# Altium project Gas_Sampler.PrjPcb (part 2 of 3)

## Sheet Gas_Sampler-Vin.SchDoc: Vin
size Tabloid; Organization: Sensible Robotics LLC; Address1: 120 E Church Ave Suite B; Address2: Ridgecrest CA, 93555; Revision: 0; SheetNumber: 3; SheetTotal: 12; ApprovedBy: Approved Name; Engineer: Mike Licitra; PageSetup: Record=PageOptions|CenterHorizontal=True|CenterVertical=True|PrintScale=0.98|XCorrection=1.00|YCorrection=1.00|PrintKind=0|BorderSize=5000000|LeftOffset=0|BottomOffset=0|Orientation=2|PaperLength=1000|PaperWidth=1000|Scale=100|PaperSource=15|PrintQuality=600|MediaType=1|DitherType=10|PaperKind=Tabloid|PrintScaleMode=1
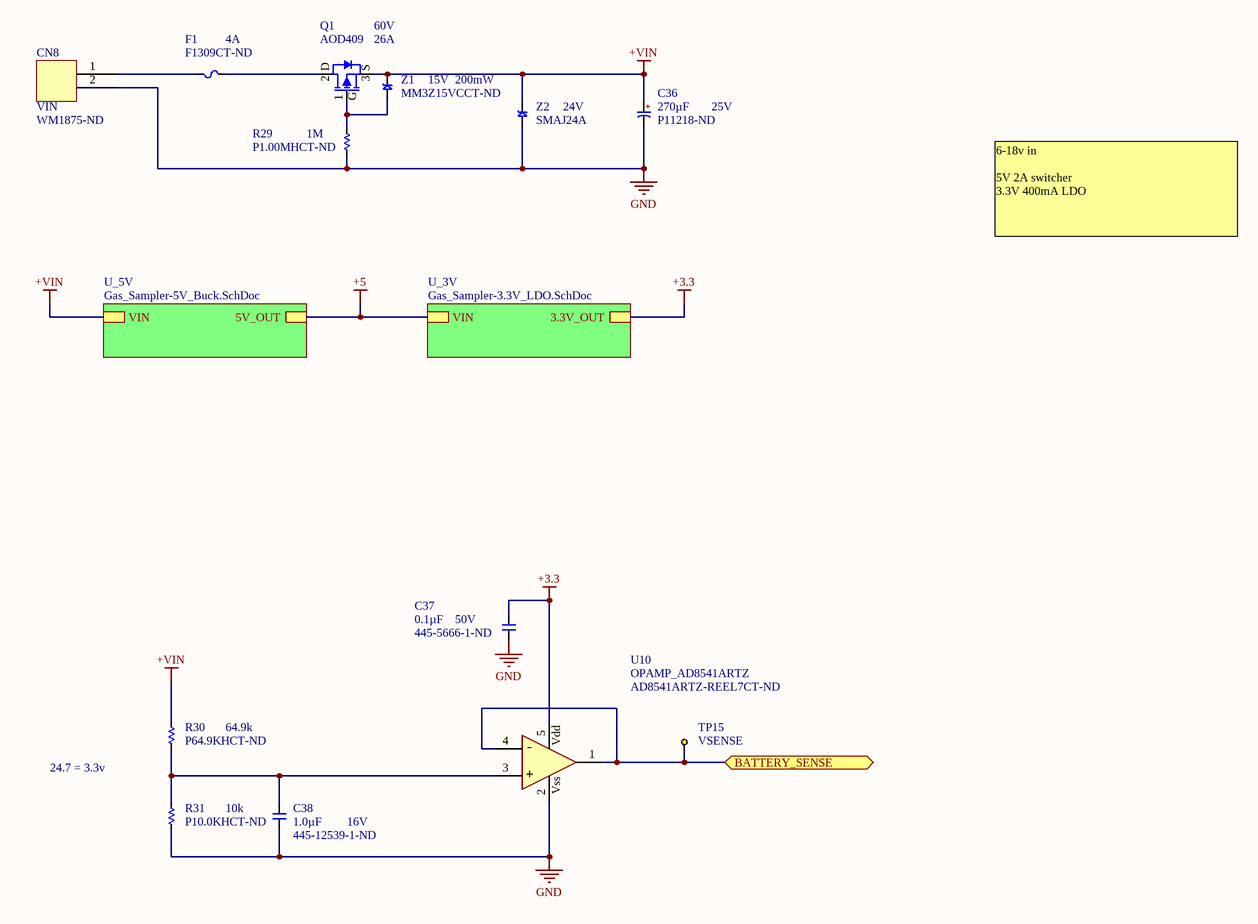
[diagram p7: Gas_Sampler-Vin.SchDoc]

### Parts
C36  value 270µF  Voltage - Rated: 25V  Supplier Part Number 1: P11218-ND  [CAP_RADIAL_10MM_DIA_12.5MM_LEN_5MM_LEADSPACE]  (hidden comment: CAP_ALUM_270UF_25V_20%_RADIAL_10X12.5MM)
C37  value 0.1µF  Voltage - Rated: 50V  Supplier Part Number 1: 445-5666-1-ND  [C0603]  (hidden comment: CAP_CER_0603_0.1UF_50V_10%_X7R)
C38  value 1.0µF  Supplier Part Number 1: 445-12539-1-ND  Voltage - Rated: 16V  [C0603]  (hidden comment: CAP_CER_0603_1UF_16V_10%_X7R)
CN8  VIN  Supplier Part Number 1: WM1875-ND  [MICROFIT_3_SINGLE_ROW_RA_TH_CLIP_2POS]
F1  Supplier Part Number 1: F1309CT-ND  Current Rating: 4A  [FUSEHOLDER_LITTLEFUSE_0154005.DR]  (hidden comment: FUSE_4A_OMNIBLOK_0154004)
Q1  Manufacturer Part Number: AOD409  Drain to Source Voltage (Vdss): 60V  Current - Continuous Drain (Id) @ 25° C: 26A  [DPAK]  (hidden comment: PFET_AOD409)
R29  value 1M  Supplier Part Number 1: P1.00MHCT-ND  [R0603]  (hidden comment: RES_0603_1M_OHM_1/10W_1%)
R30  Supplier Part Number 1: P64.9KHCT-ND  Resistance (Ohms): 64.9k  [R0603]  (hidden comment: RES_0603_64.9K_OHM_1/10W_1%)
R31  value 10k  Supplier Part Number 1: P10.0KHCT-ND  [R0603]  (hidden comment: RES_0603_10K_OHM_1/10W_1%)
TP15  VSENSE  [TP_KEYSTONE_5001]
U10  OPAMP_AD8541ARTZ  Supplier Part Number 1: AD8541ARTZ-REEL7CT-ND  [5SOT23]
Z1  Supplier Part Number 1: MM3Z15VCCT-ND  Power - Max: 200mW  Voltage - Zener (Nom) (Vz): 15V  [SOD323]  (hidden comment: ZENER_MM3Z15VC)
Z2  Voltage - Reverse Standoff (Typ): 24V  Manufacturer Part Number: SMAJ24A  [SMA]  (hidden comment: TVS_UNI_SMAJ24A)

### Sub-sheets
U_3V = Gas_Sampler-3.3V_LDO.SchDoc: VIN, 3.3V_OUT
U_5V = Gas_Sampler-5V_Buck.SchDoc: 5V_OUT, VIN

### Ports
BATTERY_SENSE

### Nets
+3.3: C37.1 U10.5(VDD) ; sheet U_3V/3.3V_OUT
+5: sheet U_5V/5V_OUT, sheet U_3V/VIN
+VIN: C36.1 Q1.3(S) R30.2 Z1.2 Z2.2 ; sheet U_5V/VIN
GND: C36.2 C37.2 C38.2 CN8.2 R29.1 R31.1 U10.2(VSS) Z2.1
BATT_SENSE: TP15.1 U10.1(OUT) U10.4(IN-) ; port BATTERY_SENSE
NetC38_1: C38.1 R30.1 R31.2 U10.3(IN+)
NetCN8_1: CN8.1 F1.1
NetF1_2: F1.2 Q1.2(D)
NetQ1_1: Q1.1(G) R29.2 Z1.1

### Notes on the sheet
- 6-18v in
  5V 2A switcher
  3.3V 400mA LDO
- 24.7 = 3.3v
- CONFIDENTIAL DOCUMENT
- DUPLICATION PROHIBITED
- ENGINEER
- PCB FAB #
- SCH #
- REV
- Sensible
- Robotics
- THIS DOCUMENT CONTAINS INFORMATION AND OR DATA, WHICH IS PROPRIETARY AND CONFIDENTIAL TO SENSIBLE ROBOTICS LLC.  THIS INFORMATION AND OR DATA, IS TO BE USED ONLY FOR THE BENEFIT OF THE SUPPLIER, AND IS NOT TO BE USED FOR THE BENEFIT OF OTHER PARTIES WITHOUT WRITTEN CONSENT.
- DATE
- PCB ASSY #
- SIZE
- Tabloid
- SHEET
- OF
- FILE
- (in symbol CAP_ALUM_270UF_25V_20%_RADIAL_10X12.5MM) +
- (in symbol OPAMP_AD8541ARTZ) Vdd; +; Vss

### Library data of the parts
C36 = CAP_ALUM_270UF_25V_20%_RADIAL_10X12.5MM: CAP ALUM 270UF 20% 25V RADIAL; Manufacturer: Panasonic Electronic Components; Manufacturer Part Number: EEU-FC1E271; Lifetime @ Temp.: 3000 Hrs @ 105°C; Polarization: Polar; Ripple Current - Low Frequency: 490.8mA @ 120Hz; Ripple Current - High Frequency: 755mA @ 100kHz; Supplier 1: Digi-Key; RoHS: RoHS Compliant; Category: Capacitors; Stock 1: 10830; Pricing 1: 1=0.53, 10=0.372, 100=0.2449, 500=0.18144, 1000=0.15422, 2500=0.14515, 5000=0.13608 (USD); Packaging: Bulk; Part Status: Active; Tolerance: ±20%; ESR (Equivalent Series Resistance): -; Operating Temperature: -55°C ~ 105°C; Applications: Automotive; Lead Spacing: 0.197" (5.00mm); Size / Dimension: 0.394" Dia (10.00mm); Height - Seated (Max): 0.492" (12.50mm); Mounting Type: Through Hole; Package / Case: Radial, Can; ComponentLink1URL: http://industrial.panasonic.com/www-cgi/jvcr13pz.cgi?E+PZ+3+ABA0022+EEUFC1E271+7+WW; ComponentLink1Description: http://industrial.panasonic.com/www-cgi/jvcr13pz.cgi?E+PZ+3+ABA0022+EEUFC1E271+7+WW
C37 = CAP_CER_0603_0.1UF_50V_10%_X7R: CAP CER 0.1UF 50V 10% X7R 0603; Manufacturer: TDK Corporation; Manufacturer Part Number: CGA3E2X7R1H104K080AA; Part Number: 150-00077-00; Supplier 1: Digi-Key; RoHS: RoHS Compliant; Category: Capacitors; Stock 1: 320000; Pricing 1: 1=0.1, 10=0.072, 100=0.033, 250=0.027, 500=0.0231, 1000=0.018 (USD); Packaging: Cut Tape (CT); Tolerance: ±10%; Temperature Coefficient: X7R; Mounting Type: Surface Mount, MLCC; Operating Temperature: -55°C ~ 125°C; Applications: Automotive; Ratings: AEC-Q200; Package / Case: 0603 (1608 Metric); Size / Dimension: 0.063" L x 0.031" W (1.60mm x 0.80mm); Height - Seated (Max): -; Thickness (Max): 0.035" (0.90mm); Lead Spacing: -; Features: -; Lead Style: -; ComponentLink1URL: http://product.tdk.com/capacitor/mlcc/en/documents/mlcc_automotive_general_en.pdf; ComponentLink1Description: http://product.tdk.com/capacitor/mlcc/en/documents/mlcc_automotive_general_en.pdf
C38 = CAP_CER_0603_1UF_16V_10%_X7R: CAP CER 1UF 16V 10% X7R 0603; Manufacturer: TDK Corporation; Manufacturer Part Number: CGA3E1X7R1C105K080AC; Supplier 1: Digi-Key; RoHS: RoHS Compliant; Packaging: Cut Tape (CT); Tolerance: ±10%; Temperature Coefficient: X7R; Mounting Type: Surface Mount, MLCC; Operating Temperature: -55°C ~ 125°C; Applications: Automotive; Ratings: AEC-Q200; Package / Case: 0603 (1608 Metric); Size / Dimension: 0.063" L x 0.031" W (1.60mm x 0.80mm); Thickness (Max): 0.035" (0.90mm); ComponentLink1URL: http://product.tdk.com/capacitor/mlcc/en/documents/mlcc_automotive_general_en.pdf; ComponentLink1Description: http://product.tdk.com/capacitor/mlcc/en/documents/mlcc_automotive_general_en.pdf
CN8 = MICROFIT_3_SINGLE_ROW_RA_TH_CLIP_2POS: CONN HEADER 2POS R/A W/CLIP GOLD; Manufacturer: Molex Connector Corporation; Manufacturer Part Number: 43650-0204; Connector Type: Header, Shrouded; Number of Positions: 2; Number of Positions Loaded: All; Pitch: 0.118" (3.00mm); Supplier 1: Digi-Key; RoHS: RoHS Compliant; Packaging: Tray; Contact Type: Male Pin; Number of Rows: 1; Mounting Type: Through Hole, Right Angle; Termination: Solder; Fastening Type: Locking Ramp; Features: Board Lock; Contact Finish: Gold; Contact Finish Thickness: 15µin (0.38µm); Color: Black; ComponentLink1URL: http://www.molex.com/pdm_docs/sd/436500204_sd.pdf; ComponentLink1Description: http://www.molex.com/pdm_docs/sd/436500204_sd.pdf
F1 = FUSE_4A_OMNIBLOK_0154004: FUSE Slow 125VAC, 125VDC 4A SMD; Manufacturer: Littelfuse Inc; Manufacturer Part Number: 0154004.DRT; Part Number: 430-00077-00; Fuse Type: Board Mount (Cartridge Style Excluded); Voltage Rating - AC: 125V; Breaking Capacity @ Rated Voltage: 50A; Melting I²t: 34.4; Approvals: PSE, UL; Color: White; DC Cold Resistance: 0.0186 Ohm; Supplier 1: Digi-Key; RoHS: RoHS Compliant; Category: Circuit Protection; Stock 1: 4331; Pricing 1: 1=3.07, 10=2.781, 25=2.632, 50=2.2414, 100=1.8972, 250=1.85072, 500=1.5624 (USD); Voltage Rating - DC: 125V; Response Time: Slow; Package / Case: 2-SMD, Square End Block with Holder; Mounting Type: Holder/Surface Mount; Operating Temperature: -55°C ~ 125°C; Size / Dimension: 0.383" L x 0.198" W x 0.150" H (9.73mm x 5.03mm x 3.81mm); Packaging: Cut Tape (CT); ComponentLink1URL: http://www.littelfuse.com/products/fuse-blocks-fuseholders-and-fuse-accessories/fuse-blocks/~/media/Files/Littelfuse/Technical%20Resources/Documents/Data%20Sheets/Littelfuse_Fuseblocks_154_155_Datasheet.pdf; ComponentLink1Description: Datasheet
Q1 = PFET_AOD409: MOSFET P-CH -60V -26A TO-252; Manufacturer: Alpha & Omega Semiconductor Inc; FET Type: MOSFET P-Channel, Metal Oxide; FET Feature: Logic Level Gate; Rds On (Max) @ Id, Vgs: 40 mOhm @ 20A, 10V; Vgs(th) (Max) @ Id: 2.4V @ 250µA; Gate Charge (Qg) @ Vgs: 54nC @ 10V; Input Capacitance (Ciss) @ Vds: 3600pF @ 30V; Power - Max: 60W; Supplier 1: Digi-Key; RoHS: RoHS Compliant; Category: Discrete Semiconductor Products; Stock 1: 20027; Pricing 1: 1=0.97, 25=0.7516, 100=0.663, 250=0.5746, 500=0.4862, 1000=0.38675 (USD); Mounting Type: Surface Mount; Package / Case: TO-252-3, DPak (2 Leads + Tab), SC-63; Supplier Device Package: TO-252, (D-Pak); Packaging: Cut Tape (CT); ComponentLink1URL: http://www.aosmd.com/res/data_sheets/AOD409.pdf; ComponentLink1Description: Datasheet; Supplier Part Number 1: 785-1103-1-ND
R29 = RES_0603_1M_OHM_1/10W_1%: RES 1M OHM 1/10W 1% 0603 SMD; Manufacturer: Panasonic Electronic Components; Manufacturer Part Number: ERJ-3EKF1004V; Power (Watts): 0.1W, 1/10W; Temperature Coefficient: ±100ppm/°C; Supplier 1: Digi-Key; RoHS: RoHS Compliant; Category: Resistors; Stock 1: 1614014; Pricing 1: 1=0.1, 50=0.0138, 100=0.0105, 250=0.0078, 500=0.00576, 1000=0.00384 (USD); Packaging: Cut Tape (CT); Composition: Thick Film; Features: -; Tolerance: ±1%; Package / Case: 0603 (1608 Metric); Supplier Device Package: 0603; Size / Dimension: 0.063" L x 0.031" W (1.60mm x 0.80mm); Height: 0.022" (0.55mm); Number of Terminations: 2; ComponentLink1URL: http://industrial.panasonic.com/www-cgi/jvcr13pz.cgi?E+PZ+3+AOA0002+ERJ3EKF1004V+7+WW; ComponentLink1Description: http://industrial.panasonic.com/www-cgi/jvcr13pz.cgi?E+PZ+3+AOA0002+ERJ3EKF1004V+7+WW
R30 = RES_0603_64.9K_OHM_1/10W_1%: RES 64.9K OHM 1% 1/10W 0603; Manufacturer: Panasonic Electronic Components; Manufacturer Part Number: ERJ3EKF6492V; Part Number: 470-02041-00; Power (Watts): 0.1W, 1/10W; Temperature Coefficient: ±100ppm/°C; Supplier 1: Digi-Key; RoHS: RoHS Compliant; Category: Resistors; Stock 1: 97260; Pricing 1: 1=0.1, 50=0.0114, 100=0.0084, 250=0.00644, 500=0.00514, 1000=0.00379 (USD); Packaging: Cut Tape (CT); Composition: Thick Film; Features: Automotive AEC-Q200; Operating Temperature: -55°C ~ 155°C; Package / Case: 0603 (1608 Metric); Supplier Device Package: 0603; Size / Dimension: 0.063" L x 0.031" W (1.60mm x 0.80mm); Height: 0.022" (0.55mm); Number of Terminations: 2; ComponentLink1URL: http://industrial.panasonic.com/www-cgi/jvcr13pz.cgi?E+PZ+3+AOA0002+ERJ3EKF6492V+7+WW; ComponentLink1Description: http://industrial.panasonic.com/www-cgi/jvcr13pz.cgi?E+PZ+3+AOA0002+ERJ3EKF6492V+7+WW; Tolerance: ±1%
R31 = RES_0603_10K_OHM_1/10W_1%: RES 10K OHM 1/10W 1% 0603 SMD; Manufacturer: Panasonic Electronic Components; Manufacturer Part Number: ERJ-3EKF1002V; Power (Watts): 0.1W, 1/10W; Temperature Coefficient: ±100ppm/°C; Supplier 1: Digi-Key; RoHS: RoHS Compliant; Packaging: Cut Tape (CT); Composition: Thick Film; Tolerance: ±1%; Package / Case: 0603 (1608 Metric); Supplier Device Package: 0603; Size / Dimension: 0.063" L x 0.031" W (1.60mm x 0.80mm); Height: 0.022" (0.55mm); Number of Terminations: 2; ComponentLink1URL: http://industrial.panasonic.com/www-cgi/jvcr13pz.cgi?E+PZ+3+AOA0002+ERJ3EKF1002V+7+WW; ComponentLink1Description: http://industrial.panasonic.com/www-cgi/jvcr13pz.cgi?E+PZ+3+AOA0002+ERJ3EKF1002V+7+WW
TP15 = TEST_KEYSTONE5001: PC TEST POINT TH RING; Manufacturer: Keystone Electronics; Manufacturer Part Number: 5001; Part Number: 250-00184-00; Supplier 1: Digi-Key; Supplier Part Number 1: 5001K-ND; RoHS: RoHS Compliant; Category: Test and Measurement; Stock 1: 341830; Pricing 1: 1=0.33, 10=0.309, 50=0.2252, 100=0.2164, 250=0.19432, 500=0.18548, 1000=0.15456, 2500=0.14131, 5000=0.13248 (USD); Packaging: Bulk; Type: PC Test Point, Miniature; Terminal: 0.010" x 0.020" (0.25mm x 0.51mm) Phosphor Bronze Wire, Silver Plate; Mounting Type: 0.040" (1.02mm) Hole Diameter; Material: Base, Nylon 46, UL 94V-0; Color: Black; ComponentLink1URL: http://www.keyelco.com/product-pdf.cfm?p=1310; ComponentLink1Description: http://www.keyelco.com/product-pdf.cfm?p=1310
U10 = OPAMP_AD8541ARTZ: IC OPAMP GP R-R CMOS SOT23-5; Manufacturer: Analog Devices Inc; Manufacturer Part Number: AD8541ARTZ-REEL7; Part Number: 480-00120-00; Amplifier Type: General Purpose; Number of Circuits: 1; Output Type: Rail-to-Rail; Slew Rate: 0.92 V/µs; Gain Bandwidth Product: 1MHz; Current - Input Bias: 4pA; Voltage - Input Offset: 1mV; Current - Supply: 45µA; Current - Output / Channel: 30mA; Voltage - Supply, Single/Dual (±): 2.7 V ~ 5.5 V; Supplier 1: Digi-Key; RoHS: RoHS Compliant; Category: Integrated Circuits (ICs); Stock 1: 26612; Pricing 1: 1=0.85, 10=0.747, 25=0.6604, 100=0.5755, 250=0.50096, 500=0.42642, 1000=0.34155 (USD); Packaging: Cut Tape (CT); -3db Bandwidth: -; Operating Temperature: -40°C ~ 125°C; Mounting Type: Surface Mount; Package / Case: SC-74A, SOT-753; Supplier Device Package: SOT-23-5; ComponentLink1URL: http://www.analog.com/static/imported-files/data_sheets/AD8541_8542_8544.pdf; ComponentLink1Description: http://www.analog.com/static/imported-files/data_sheets/AD8541_8542_8544.pdf
Z1 = ZENER_MM3Z15VC: DIODE ZENER 15V 200MW SOD; Manufacturer: Fairchild Semiconductor; Part Number: 480-00176-00; Voltage - Forward (Vf) (Max) @ If: 1V @ 10mA; Current - Reverse Leakage @ Vr: 45nA @ 10.5V; Impedance (Max) (Zzt): 28 Ohm; Tolerance: ±5%; Supplier 1: Digi-Key; Manufacturer Part Number: MM3Z15VC; RoHS: RoHS Compliant; Category: Discrete Semiconductor Products; Stock 1: 30597; Pricing 1: 1=0.44, 10=0.29, 100=0.126, 250=0.08192, 500=0.05796, 750=0.04788, 1000=0.04095 (USD); Mounting Type: Surface Mount; Package / Case: SC-90, SOD-323F; Supplier Device Package: SOD-323F; Packaging: Cut Tape (CT); Operating Temperature: -65°C ~ 150°C; ComponentLink1URL: http://www.fairchildsemi.com/ds/MM/MM3Z10VC.pdf; ComponentLink1Description: Datasheet
Z2 = TVS_UNI_SMAJ24A: TVS DIODE 24VWM SMD; Manufacturer: Bourns Inc.; Part Number: 430-00161-00; Unidirectional Channels: 1; Voltage - Breakdown (Min): 26.7V; Power - Peak Pulse: 400W; Power Line Protection: No; Supplier 1: Digi-Key; Supplier Part Number 1: SMAJ24ABCT-ND; RoHS: RoHS Compliant; Category: Circuit Protection; Stock 1: 27086; Pricing 1: 1=0.53, 10=0.377, 25=0.3096, 100=0.2473, 250=0.1802, 500=0.14632, 1000=0.11248, 2500=0.10101 (USD); Packaging: Cut Tape (CT); Type: Zener; Bidirectional Channels: -; Voltage - Clamping (Max) @ Ipp: -; Current - Peak Pulse (10/1000µs): -; Applications: General Purpose; Capacitance @ Frequency: -; Operating Temperature: -55°C ~ 150°C (TJ); Mounting Type: Surface Mount; Package / Case: DO-214AC, SMA; Supplier Device Package: SMA (DO-214AC); ComponentLink1URL: http://www.bourns.com/data/global/pdfs/SMAJ.pdf; ComponentLink1Description: http://www.bourns.com/data/global/pdfs/SMAJ.pdf

## Sheet Gas_Sampler-5V_Buck.SchDoc: 5V Buck
size Tabloid; Organization: Sensible Robotics LLC; Address1: 120 E Church Ave Suite B; Address2: Ridgecrest CA, 93555; Revision: 0; SheetNumber: 4; SheetTotal: 12; ApprovedBy: Approved Name; Engineer: Mike Licitra; PageSetup: Record=PageOptions|CenterHorizontal=True|CenterVertical=True|PrintScale=0.98|XCorrection=1.00|YCorrection=1.00|PrintKind=0|BorderSize=5000000|LeftOffset=0|BottomOffset=0|Orientation=2|PaperLength=1000|PaperWidth=1000|Scale=100|PaperSource=15|PrintQuality=600|MediaType=1|DitherType=10|PaperKind=Tabloid|PrintScaleMode=1
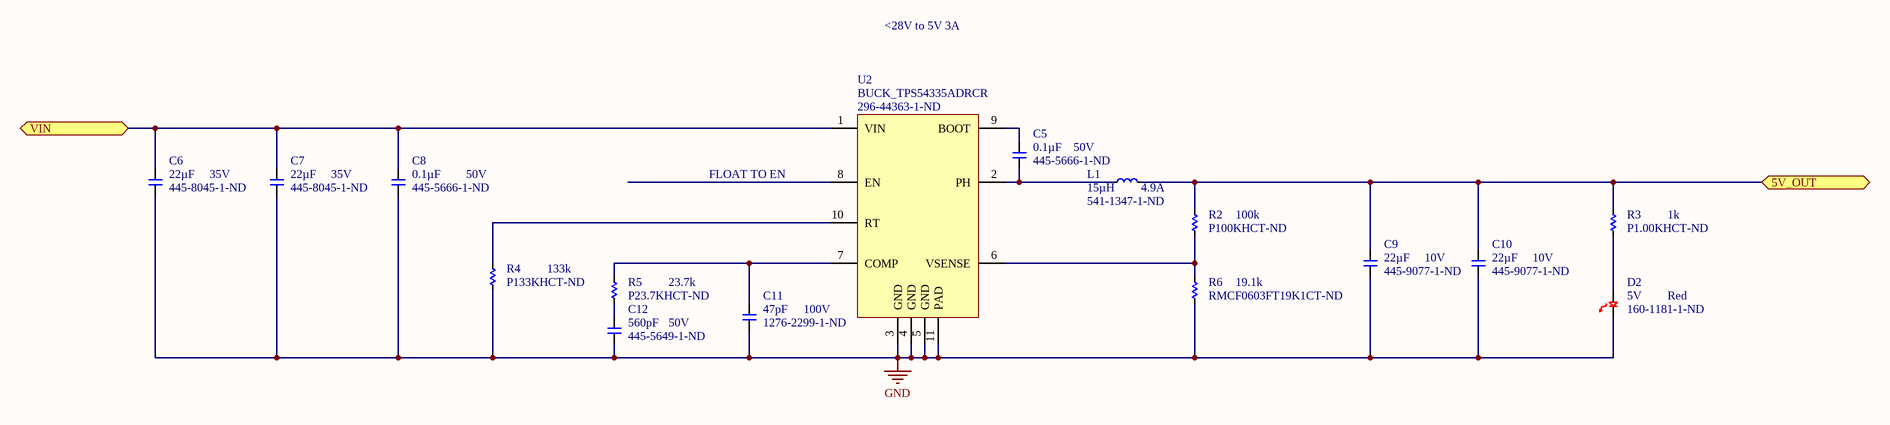
[diagram p8: Gas_Sampler-5V_Buck.SchDoc]

### Parts
C5  value 0.1µF  Voltage - Rated: 50V  Supplier Part Number 1: 445-5666-1-ND  [C0603]  (hidden comment: CAP_CER_0603_0.1UF_50V_10%_X7R)
C6  value 22µF  Voltage - Rated: 35V  Supplier Part Number 1: 445-8045-1-ND  [C1206]  (hidden comment: CAP_CER_1206_22UF_35V_20%_X5R)
C7  value 22µF  Voltage - Rated: 35V  Supplier Part Number 1: 445-8045-1-ND  [C1206]  (hidden comment: CAP_CER_1206_22UF_35V_20%_X5R)
C8  value 0.1µF  Voltage - Rated: 50V  Supplier Part Number 1: 445-5666-1-ND  [C0603]  (hidden comment: CAP_CER_0603_0.1UF_50V_10%_X7R)
C9  value 22µF  Supplier Part Number 1: 445-9077-1-ND  Voltage - Rated: 10V  [C0603]  (hidden comment: CAP_CER_0603_22UF_10V_20%_X5R)
C10  value 22µF  Supplier Part Number 1: 445-9077-1-ND  Voltage - Rated: 10V  [C0603]  (hidden comment: CAP_CER_0603_22UF_10V_20%_X5R)
C11  value 47pF  Voltage - Rated: 100V  Supplier Part Number 1: 1276-2299-1-ND  [C0603]  (hidden comment: CAP_CER_0603_47PF_100V_5%_NP0)
C12  value 560pF  Supplier Part Number 1: 445-5649-1-ND  Voltage - Rated: 50V  [C0603]  (hidden comment: CAP_CER_0603_560PF_50V_5%_NP0)
D2  5V  Supplier Part Number 1: 160-1181-1-ND  Color: Red  [LED_0603_RED]
L1  value 15µH  Current Rating: 4.9A  Supplier Part Number 1: 541-1347-1-ND  [INDUCTOR_IHLP3232_4MM_HEIGHT]  (hidden comment: IND_15UH_4.9A_IHLP3232DZER150M11)
R2  value 100k  Supplier Part Number 1: P100KHCT-ND  [R0603]  (hidden comment: RES_0603_100K_OHM_1/10W_1%)
R3  value 1k  Supplier Part Number 1: P1.00KHCT-ND  [R0603]  (hidden comment: RES_0603_1K_OHM_1/10W_1%)
R4  value 133k  Supplier Part Number 1: P133KHCT-ND  [R0603]  (hidden comment: RES_0603_133K_OHM_1/10W_1%)
R5  value 23.7k  Supplier Part Number 1: P23.7KHCT-ND  [R0603]  (hidden comment: RES_0603_23.7K_OHMS_1/10W_1%)
R6  value 19.1k  Supplier Part Number 1: RMCF0603FT19K1CT-ND  [R0603]  (hidden comment: RES_0603_19.1K_OHM_1/10W_1%)
U2  BUCK_TPS54335ADRCR  Supplier Part Number 1: 296-44363-1-ND  [PVSON50P300X300X70-10N]

### Ports
5V_OUT, VIN

### Nets
+5: C9.1 C10.1 L1.2 R2.2 R3.2 ; port 5V_OUT
+VIN: C6.1 C7.1 C8.1 U2.1(VIN) ; port VIN
GND: C6.2 C7.2 C8.2 C9.2 C10.2 C11.2 C12.2 D2.2(CATHODE) R4.1 R6.1 U2.3(GND) U2.4(GND) U2.5(GND) U2.11(PAD)
NetC5_1: C5.1 U2.9(BOOT)
NetC5_2: C5.2 L1.1 U2.2(PH)
NetC11_1: C11.1 R5.2 U2.7(COMP)
NetC12_1: C12.1 R5.1
NetD2_1: D2.1(ANODE) R3.1
NetR2_1: R2.1 R6.2 U2.6(VSENSE)
NetR4_2: R4.2 U2.10(RT)

Not connected (* = marked no-connect by the designer): U2 8(EN)

### Notes on the sheet
- <28V to 5V 3A
- FLOAT TO EN
- CONFIDENTIAL DOCUMENT
- DUPLICATION PROHIBITED
- ENGINEER
- PCB FAB #
- SCH #
- REV
- Sensible
- Robotics
- THIS DOCUMENT CONTAINS INFORMATION AND OR DATA, WHICH IS PROPRIETARY AND CONFIDENTIAL TO SENSIBLE ROBOTICS LLC.  THIS INFORMATION AND OR DATA, IS TO BE USED ONLY FOR THE BENEFIT OF THE SUPPLIER, AND IS NOT TO BE USED FOR THE BENEFIT OF OTHER PARTIES WITHOUT WRITTEN CONSENT.
- DATE
- PCB ASSY #
- SIZE
- Tabloid
- SHEET
- OF
- FILE

### Library data of the parts
C5 C8 = CAP_CER_0603_0.1UF_50V_10%_X7R: as C22 on sheet Gas_Sampler-BME_280; Supplier 1: Digi-Key; RoHS: RoHS Compliant; Packaging: Cut Tape (CT); Tolerance: ±10%; Temperature Coefficient: X7R; Mounting Type: Surface Mount, MLCC; Operating Temperature: -55°C ~ 125°C; Applications: Automotive; Ratings: AEC-Q200; Package / Case: 0603 (1608 Metric); Size / Dimension: 0.063" L x 0.031" W (1.60mm x 0.80mm); Thickness (Max): 0.035" (0.90mm); ComponentLink1URL: http://product.tdk.com/capacitor/mlcc/en/documents/mlcc_automotive_general_en.pdf; ComponentLink1Description: http://product.tdk.com/capacitor/mlcc/en/documents/mlcc_automotive_general_en.pdf
C6 C7 = CAP_CER_1206_22UF_35V_20%_X5R: CAP CER 22UF 35V X5R 1206; Manufacturer: TDK Corporation; Manufacturer Part Number: C3216X5R1V226M160AC; Tolerance: ±20%; Supplier 1: Digi-Key; RoHS: RoHS Compliant; Packaging: Cut Tape (CT); Temperature Coefficient: X5R; Mounting Type: Surface Mount, MLCC; Operating Temperature: -55°C ~ 85°C; Applications: General Purpose; Package / Case: 1206 (3216 Metric); Size / Dimension: 0.126" L x 0.063" W (3.20mm x 1.60mm); Thickness (Max): 0.071" (1.80mm); Features: Low ESL; ComponentLink1URL: https://product.tdk.com/info/en/catalog/datasheets/mlcc_commercial_general_en.pdf; ComponentLink1Description: https://product.tdk.com/info/en/catalog/datasheets/mlcc_commercial_general_en.pdf
C9 C10 = CAP_CER_0603_22UF_10V_20%_X5R: CAP CER 22UF 10V 20% X5R 0603; Manufacturer: TDK Corporation; Manufacturer Part Number: C1608X5R1A226M080AC; Part Number: 150-00202-00; Supplier 1: Digi-Key; Temperature Coefficient: X5R; Tolerance: ±20%
C11 = CAP_CER_0603_47PF_100V_5%_NP0: CAP CER 47PF 100V C0G/NP0 0603; Manufacturer: Samsung Electro-Mechanics; Manufacturer Part Number: CL10C470JC8NNNC; Tolerance: ±5%; Temperature Coefficient: C0G, NP0; Supplier 1: Digi-Key; RoHS: RoHS Compliant; Packaging: Cut Tape (CT); Mounting Type: Surface Mount, MLCC; Operating Temperature: -55°C ~ 125°C; Applications: General Purpose; Package / Case: 0603 (1608 Metric); Size / Dimension: 0.063" L x 0.031" W (1.60mm x 0.80mm); Thickness (Max): 0.035" (0.90mm); ComponentLink1URL: http://www.samsungsem.com/kr/support/product-search/mlcc/CL10C470JC8NNNC.jsp; ComponentLink1Description: Datasheet
C12 = CAP_CER_0603_560PF_50V_5%_NP0: CAP CER 560PF 50V 5% NP0 0603; Manufacturer: TDK Corporation; Manufacturer Part Number: CGA3E2C0G1H561J080AA; Temperature Coefficient: C0G, NP0; Supplier 1: Digi-Key; RoHS: RoHS Compliant; Packaging: Cut Tape (CT); Tolerance: ±5%; Mounting Type: Surface Mount, MLCC; Operating Temperature: -55°C ~ 125°C; Applications: Automotive; Ratings: AEC-Q200; Package / Case: 0603 (1608 Metric); Size / Dimension: 0.063" L x 0.031" W (1.60mm x 0.80mm); Thickness (Max): 0.035" (0.90mm); ComponentLink1URL: http://product.tdk.com/capacitor/mlcc/en/documents/mlcc_automotive_general_en.pdf; ComponentLink1Description: http://product.tdk.com/capacitor/mlcc/en/documents/mlcc_automotive_general_en.pdf
D2 = LED_0603_RED_LR_LTST-C190CKT: LED RED CLEAR 0603 SMD; Manufacturer: Lite-On Inc; Millicandela Rating: 10mcd; Wavelength - Dominant: 638nm; Wavelength - Peak: 660nm; Viewing Angle: 130°; Lens Style/Size: Rectangle with Flat Top, 1.1mm x 0.8mm; Voltage - Forward (Vf) Typ: 1.8V; Current - Test: 10mA; Supplier 1: Digi-Key; Manufacturer Part Number: LTST-C190CKT; Lens Type: Clear; Package / Case: 0603 (1608 Metric); Size / Dimension: 1.60mm L x 0.80mm W; Height: 0.80mm; Mounting Type: Surface Mount; Packaging: Cut Tape (CT); ComponentLink1URL: http://media.digikey.com/pdf/Data%20Sheets/Lite-On%20PDFs/LTST-C190CKT.pdf; ComponentLink1Description: Datasheet
L1 = IND_15UH_4.9A_IHLP3232DZER150M11: INDUCTOR POWER 15UH 4.9A SMD; Manufacturer: Vishay Dale; Tolerance: ±20%; Current - Saturation: 3.7A; Shielding: Shielded; DC Resistance (DCR): 65.3 mOhm Max; Frequency - Test: 100kHz; Supplier 1: Digi-Key; Manufacturer Part Number: IHLP3232DZER150M11; RoHS: RoHS Compliant; Category: Inductors, Coils, Chokes; Packaging: Cut Tape (CT); Operating Temperature: -55°C ~ 125°C; Mounting Type: Surface Mount; Package / Case: Non Standard; Size / Dimension: 0.340" L x 0.322" W (8.64mm x 8.18mm); Height - Seated (Max): 0.158" (4.00mm); ComponentLink1URL: http://media.digikey.com/PDF/Data%20Sheets/Vishay%20Dale%20PDFs/IHLP-3232DZ-11.pdf; ComponentLink1Description: http://media.digikey.com/PDF/Data%20Sheets/Vishay%20Dale%20PDFs/IHLP-3232DZ-11.pdf
R2 = RES_0603_100K_OHM_1/10W_1%: RES 100K OHM 1/10W 1% 0603 SMD; Manufacturer: Panasonic Electronic Components; Manufacturer Part Number: ERJ-3EKF1003V; Part Number: 470-00120-00; Power (Watts): 0.1W, 1/10W; Temperature Coefficient: ±100ppm/°C; Supplier 1: Digi-Key; RoHS: RoHS Compliant; Category: Resistors; Stock 1: 8082554; Pricing 1: 1=0.1, 50=0.0138, 100=0.0105, 250=0.0078, 500=0.00576, 1000=0.00384 (USD); Packaging: Cut Tape (CT); Composition: Thick Film; Features: -; Tolerance: ±1%; Package / Case: 0603 (1608 Metric); Supplier Device Package: 0603; Size / Dimension: 0.063" L x 0.031" W (1.60mm x 0.80mm); Height: 0.022" (0.55mm); Number of Terminations: 2; ComponentLink1URL: http://industrial.panasonic.com/www-cgi/jvcr13pz.cgi?E+PZ+3+AOA0002+ERJ3EKF1003V+7+WW; ComponentLink1Description: http://industrial.panasonic.com/www-cgi/jvcr13pz.cgi?E+PZ+3+AOA0002+ERJ3EKF1003V+7+WW
R3 = RES_0603_1K_OHM_1/10W_1%: RES 1K OHM 1/10W 1% 0603 SMD; Manufacturer: Panasonic Electronic Components; Manufacturer Part Number: ERJ-3EKF1001V; Power (Watts): 0.1W, 1/10W; Temperature Coefficient: ±100ppm/°C; Supplier 1: Digi-Key; RoHS: RoHS Compliant; Packaging: Cut Tape (CT); Composition: Thick Film; Features: -; Tolerance: ±1%; Package / Case: 0603 (1608 Metric); Supplier Device Package: 0603; Size / Dimension: 0.063" L x 0.031" W (1.60mm x 0.80mm); Height: 0.022" (0.55mm); Number of Terminations: 2; ComponentLink1URL: http://industrial.panasonic.com/www-cgi/jvcr13pz.cgi?E+PZ+3+AOA0002+ERJ3EKF1001V+7+WW; ComponentLink1Description: http://industrial.panasonic.com/www-cgi/jvcr13pz.cgi?E+PZ+3+AOA0002+ERJ3EKF1001V+7+WW
R4 = RES_0603_133K_OHM_1/10W_1%: RES 133K OHM 1% 1/10W 0603; Manufacturer: Panasonic Electronic Components; Manufacturer Part Number: ERJ-3EKF1333V; Power (Watts): 0.1W, 1/10W; Temperature Coefficient: ±100ppm/°C; Supplier 1: Digi-Key; Packaging: Cut Tape (CT); Tolerance: ±1%; Composition: Thick Film; Features: Automotive AEC-Q200; Operating Temperature: -55°C ~ 155°C; Package / Case: 0603 (1608 Metric); Supplier Device Package: 0603; Height: 0.022" (0.55mm); Number of Terminations: 2; ComponentLink1URL: http://industrial.panasonic.com/www-cgi/jvcr13pz.cgi?E+PZ+3+AOA0002+ERJ3EKF1183V+7+WW; ComponentLink1Description: http://industrial.panasonic.com/www-cgi/jvcr13pz.cgi?E+PZ+3+AOA0002+ERJ3EKF1183V+7+WW
R5 = RES_0603_23.7K_OHMS_1/10W_1%: RES 23.7K OHM 1% 1/10W 0603; Manufacturer: Panasonic Electronic Components; Manufacturer Part Number: ERJ-3EKF2372V; Power (Watts): 0.1W, 1/10W; Temperature Coefficient: ±100ppm/°C; Supplier 1: Digi-Key; RoHS: RoHS Compliant; Category: Resistors; Stock 1: 58901; Pricing 1: 1=0.1, 10=0.063, 100=0.0257, 1000=0.01153, 2500=0.01001 (USD); Packaging: Cut Tape (CT); Part Status: Active; Tolerance: ±1%; Composition: Thick Film; Features: Automotive AEC-Q200; Operating Temperature: -55°C ~ 155°C; Package / Case: 0603 (1608 Metric); Supplier Device Package: 0603; Size / Dimension: 0.063" L x 0.032" W (1.60mm x 0.80mm); Height - Seated (Max): 0.022" (0.55mm); ComponentLink1URL: https://industrial.panasonic.com/cdbs/www-data/pdf/RDA0000/AOA0000C304.pdf; ComponentLink1Description: https://industrial.panasonic.com/cdbs/www-data/pdf/RDA0000/AOA0000C304.pdf
R6 = RES_0603_19.1K_OHM_1/10W_1%: RES 19.1K OHM 1% 1/10W 0603; Manufacturer: Stackpole Electronics Inc; Manufacturer Part Number: RMCF0603FT19K1; Power (Watts): 0.1W, 1/10W; Temperature Coefficient: ±100ppm/°C; Supplier 1: Digi-Key; Packaging: Cut Tape (CT); Tolerance: ±1%; Composition: Thick Film; Features: Moisture Resistant; Operating Temperature: -55°C ~ 155°C; Package / Case: 0603 (1608 Metric); Supplier Device Package: 0603; Height: 0.022" (0.55mm); Number of Terminations: 2; ComponentLink1URL: https://www.seielect.com/catalog/sei-rmcf_rmcp.pdf; ComponentLink1Description: https://www.seielect.com/catalog/sei-rmcf_rmcp.pdf
U2 = BUCK_TPS54335ADRCR: IC REG BUCK ADJUSTABLE 3A 10VSON; Manufacturer: Texas Instruments; Function: Step-Down; Output Configuration: Positive; Number of Outputs: 1; Voltage - Input (Min): 4.5V; Voltage - Input (Max): 28V; Voltage - Output (Min/Fixed): 0.8V; Voltage - Output (Max): 24V; Frequency - Switching: 50kHz ~ 1.5MHz; Synchronous Rectifier: Yes; Supplier 1: Digi-Key; Manufacturer Part Number: TPS54335ADRCR; Packaging: Cut Tape (CT); Topology: Buck; Output Type: Adjustable; Current - Output: 3A; Operating Temperature: -40°C ~ 85°C (TA); Mounting Type: Surface Mount; Package / Case: 10-VFDFN Exposed Pad; Supplier Device Package: 10-VSON (3x3); ComponentLink1URL: http://www.ti.com/general/docs/suppproductinfo.tsp?distId=10&gotoUrl=http%3A%2F%2Fwww.ti.com%2Flit%2Fgpn%2Ftps54335a; ComponentLink1Description: http://www.ti.com/general/docs/suppproductinfo.tsp?distId=10&gotoUrl=http%3A%2F%2Fwww.ti.com%2Flit%2Fgpn%2Ftps54335a

## Sheet Gas_Sampler-3.3V_LDO.SchDoc: 3.3V LDO
size Tabloid; Organization: Sensible Robotics LLC; Address1: 120 E Church Ave Suite B; Address2: Ridgecrest CA, 93555; Revision: 0; SheetNumber: 5; SheetTotal: 12; ApprovedBy: Approved Name; Engineer: Mike Licitra; PageSetup: Record=PageOptions|CenterHorizontal=True|CenterVertical=True|PrintScale=0.98|XCorrection=1.00|YCorrection=1.00|PrintKind=0|BorderSize=5000000|LeftOffset=0|BottomOffset=0|Orientation=2|PaperLength=1000|PaperWidth=1000|Scale=100|PaperSource=15|PrintQuality=600|MediaType=1|DitherType=10|PaperKind=Tabloid|PrintScaleMode=1
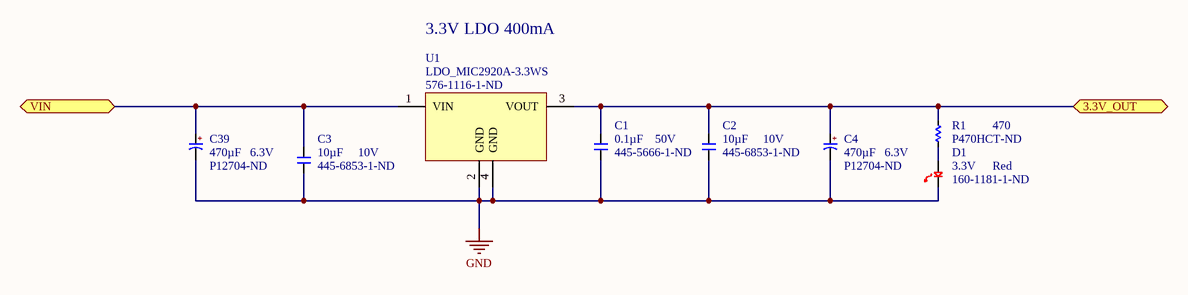
[diagram p9: Gas_Sampler-3.3V_LDO.SchDoc]

### Parts
C1  value 0.1µF  Voltage - Rated: 50V  Supplier Part Number 1: 445-5666-1-ND  [C0603]  (hidden comment: CAP_CER_0603_0.1UF_50V_10%_X7R)
C2  value 10µF  Voltage - Rated: 10V  Supplier Part Number 1: 445-6853-1-ND  [C0603]  (hidden comment: CAP_CER_0603_10UF_10V_20%_X5R)
C3  value 10µF  Voltage - Rated: 10V  Supplier Part Number 1: 445-6853-1-ND  [C0603]  (hidden comment: CAP_CER_0603_10UF_10V_20%_X5R)
C4  value 470µF  Voltage - Rated: 6.3V  Supplier Part Number 1: P12704-ND  [CAP_RADIAL_8MM_DIA_11.5MM_LEN_3.5MM_LEADSPACE]  (hidden comment: CAP_ALUM_470UF_6.3V_20%_RADIAL_8X11.5MM)
C39  value 470µF  Voltage - Rated: 6.3V  Supplier Part Number 1: P12704-ND  [CAP_RADIAL_8MM_DIA_11.5MM_LEN_3.5MM_LEADSPACE]  (hidden comment: CAP_ALUM_470UF_6.3V_20%_RADIAL_8X11.5MM)
D1  3.3V  Supplier Part Number 1: 160-1181-1-ND  Color: Red  [LED_0603_RED]
R1  value 470  Supplier Part Number 1: P470HCT-ND  [R0603]  (hidden comment: RES_0603_470_OHM_1/10W_1%)
U1  LDO_MIC2920A-3.3WS  Supplier Part Number 1: 576-1116-1-ND  [4SOT223]

### Ports
3.3V_OUT, VIN

### Nets
+3.3: C1.1 C2.1 C4.1 R1.2 U1.3(VOUT) ; port 3.3V_OUT
+5: C3.1 C39.1 U1.1(VIN) ; port VIN
GND: C1.2 C2.2 C3.2 C4.2 C39.2 D1.2(CATHODE) U1.2(GND) U1.4(GND)
NetD1_1: D1.1(ANODE) R1.1

### Notes on the sheet
- 3.3V LDO 400mA
- CONFIDENTIAL DOCUMENT
- DUPLICATION PROHIBITED
- ENGINEER
- PCB FAB #
- SCH #
- REV
- Sensible
- Robotics
- THIS DOCUMENT CONTAINS INFORMATION AND OR DATA, WHICH IS PROPRIETARY AND CONFIDENTIAL TO SENSIBLE ROBOTICS LLC.  THIS INFORMATION AND OR DATA, IS TO BE USED ONLY FOR THE BENEFIT OF THE SUPPLIER, AND IS NOT TO BE USED FOR THE BENEFIT OF OTHER PARTIES WITHOUT WRITTEN CONSENT.
- DATE
- PCB ASSY #
- SIZE
- Tabloid
- SHEET
- OF
- FILE
- (in symbol CAP_ALUM_470UF_6.3V_20%_RADIAL_8X11.5MM) +

### Library data of the parts
C1 = CAP_CER_0603_0.1UF_50V_10%_X7R: as C37 on sheet Gas_Sampler-Vin; Supplier 1: Digi-Key; RoHS: RoHS Compliant; Category: Capacitors; Stock 1: 320000; Pricing 1: 1=0.1, 10=0.072, 100=0.033, 250=0.027, 500=0.0231, 1000=0.018 (USD); Packaging: Cut Tape (CT); Tolerance: ±10%; Temperature Coefficient: X7R; Mounting Type: Surface Mount, MLCC; Operating Temperature: -55°C ~ 125°C; Applications: Automotive; Ratings: AEC-Q200; Package / Case: 0603 (1608 Metric); Size / Dimension: 0.063" L x 0.031" W (1.60mm x 0.80mm); Height - Seated (Max): -; Thickness (Max): 0.035" (0.90mm); Lead Spacing: -; Features: -; Lead Style: -; ComponentLink1URL: http://product.tdk.com/capacitor/mlcc/en/documents/mlcc_automotive_general_en.pdf; ComponentLink1Description: http://product.tdk.com/capacitor/mlcc/en/documents/mlcc_automotive_general_en.pdf
C2 C3 = CAP_CER_0603_10UF_10V_20%_X5R: CAP CER 10UF 10V X5R 0603; Manufacturer: TDK Corporation; Manufacturer Part Number: C1608X5R1A106M080AC; Tolerance: ±20%; Supplier 1: Digi-Key; RoHS: RoHS Compliant; Packaging: Cut Tape (CT); Part Status: Active; Temperature Coefficient: X5R; Operating Temperature: -55°C ~ 85°C; Features: Low ESL; Applications: General Purpose; Mounting Type: Surface Mount, MLCC; Package / Case: 0603 (1608 Metric); Size / Dimension: 0.063" L x 0.032" W (1.60mm x 0.80mm); Thickness (Max): 0.035" (0.90mm); ComponentLink1URL: https://product.tdk.com/info/en/catalog/datasheets/mlcc_commercial_general_en.pdf; ComponentLink1Description: https://product.tdk.com/info/en/catalog/datasheets/mlcc_commercial_general_en.pdf
C4 C39 = CAP_ALUM_470UF_6.3V_20%_RADIAL_8X11.5MM: CAP ALUM 470UF 6.3V 20% RADIAL; Manufacturer: Panasonic Electronic Components; Manufacturer Part Number: EEU-FC0J471; Part Number: 150-00053-00; Lifetime @ Temp.: 2000 Hrs @ 105°C; Ripple Current: 555mA; Impedance: 117 mOhm; Supplier 1: Digi-Key; RoHS: RoHS Compliant; Category: Capacitors; Stock 1: 89301; Pricing 1: 1=0.48, 50=0.2352, 100=0.2016, 500=0.1512, 1000=0.12768, 5000=0.11424, 10000=0.10752, 25000=0.1008 (USD); Packaging: Bulk; Tolerance: ±20%; Operating Temperature: -55°C ~ 105°C; Features: General Purpose; ESR (Equivalent Series Resistance): -; Mounting Type: Through Hole; Package / Case: Radial, Can; Size / Dimension: 0.315" Dia (8.00mm); Height - Seated (Max): 0.453" (11.50mm); Lead Spacing: 0.138" (3.50mm); Surface Mount Land Size: -; ComponentLink1URL: http://industrial.panasonic.com/www-cgi/jvcr13pz.cgi?E+PZ+3+ABA0022+EEUFC0J471+7+WW; ComponentLink1Description: http://industrial.panasonic.com/www-cgi/jvcr13pz.cgi?E+PZ+3+ABA0022+EEUFC0J471+7+WW
D1 = LED_0603_RED_LR_LTST-C190CKT: as D2 on sheet Gas_Sampler-5V_Buck; Supplier 1: Digi-Key; Manufacturer Part Number: LTST-C190CKT; Lens Type: Clear; Package / Case: 0603 (1608 Metric); Size / Dimension: 1.60mm L x 0.80mm W; Height: 0.80mm; Mounting Type: Surface Mount; Packaging: Cut Tape (CT); ComponentLink1URL: http://media.digikey.com/pdf/Data%20Sheets/Lite-On%20PDFs/LTST-C190CKT.pdf; ComponentLink1Description: Datasheet
R1 = RES_0603_470_OHM_1/10W_1%: RES 470 OHM 1/10W 1% 0603 SMD; Manufacturer: Panasonic Electronic Components; Manufacturer Part Number: ERJ-3EKF4700V; Part Number: 470-00157-00; Power (Watts): 0.1W, 1/10W; Temperature Coefficient: ±100ppm/°C; Supplier 1: Digi-Key; RoHS: RoHS Compliant; Category: Resistors; Stock 1: 212428; Pricing 1: 1=0.1, 50=0.0138, 100=0.0105, 250=0.0078, 500=0.00576, 1000=0.00384 (USD); Packaging: Cut Tape (CT); Composition: Thick Film; Features: -; Tolerance: ±1%; Package / Case: 0603 (1608 Metric); Supplier Device Package: 0603; Size / Dimension: 0.063" L x 0.031" W (1.60mm x 0.80mm); Height: 0.022" (0.55mm); Number of Terminations: 2; ComponentLink1URL: http://industrial.panasonic.com/www-cgi/jvcr13pz.cgi?E+PZ+3+AOA0002+ERJ3EKF4700V+7+WW; ComponentLink1Description: http://industrial.panasonic.com/www-cgi/jvcr13pz.cgi?E+PZ+3+AOA0002+ERJ3EKF4700V+7+WW
U1 = LDO_MIC2920A-3.3WS: IC REG LDO 3.3V 0.4A SOT223; Manufacturer: Microchip Technology; Manufacturer Part Number: MIC2920A-3.3WS-TR; Regulator Topology: Positive Fixed; Current - Output: 400mA; Voltage - Dropout (Typical): 0.4V @ 400mA; Number of Regulators: 1; Voltage - Input: Up to 26V; Supplier 1: Digi-Key; Packaging: Cut Tape (CT); Voltage - Output: 3.3V; Operating Temperature: -40°C ~ 125°C; Mounting Type: Surface Mount; Package / Case: TO-261-4, TO-261AA; Supplier Device Package: SOT-223; ComponentLink1URL: http://www.microchip.com/mymicrochip/filehandler.aspx?ddocname=en580793; ComponentLink1Description: http://www.microchip.com/mymicrochip/filehandler.aspx?ddocname=en580793

## Sheet Gas_Sampler-Sensors.SchDoc: Sensors
size Tabloid; Organization: Sensible Robotics LLC; Address1: 120 E Church Ave Suite B; Address2: Ridgecrest CA, 93555; Revision: 0; SheetNumber: 9; SheetTotal: 12; ApprovedBy: Approved Name; Engineer: Mike Licitra; PageSetup: Record=PageOptions|CenterHorizontal=True|CenterVertical=True|PrintScale=0.98|XCorrection=1.00|YCorrection=1.00|PrintKind=0|BorderSize=5000000|LeftOffset=0|BottomOffset=0|Orientation=2|PaperLength=1000|PaperWidth=1000|Scale=100|PaperSource=15|PrintQuality=600|MediaType=1|DitherType=10|PaperKind=Tabloid|PrintScaleMode=1
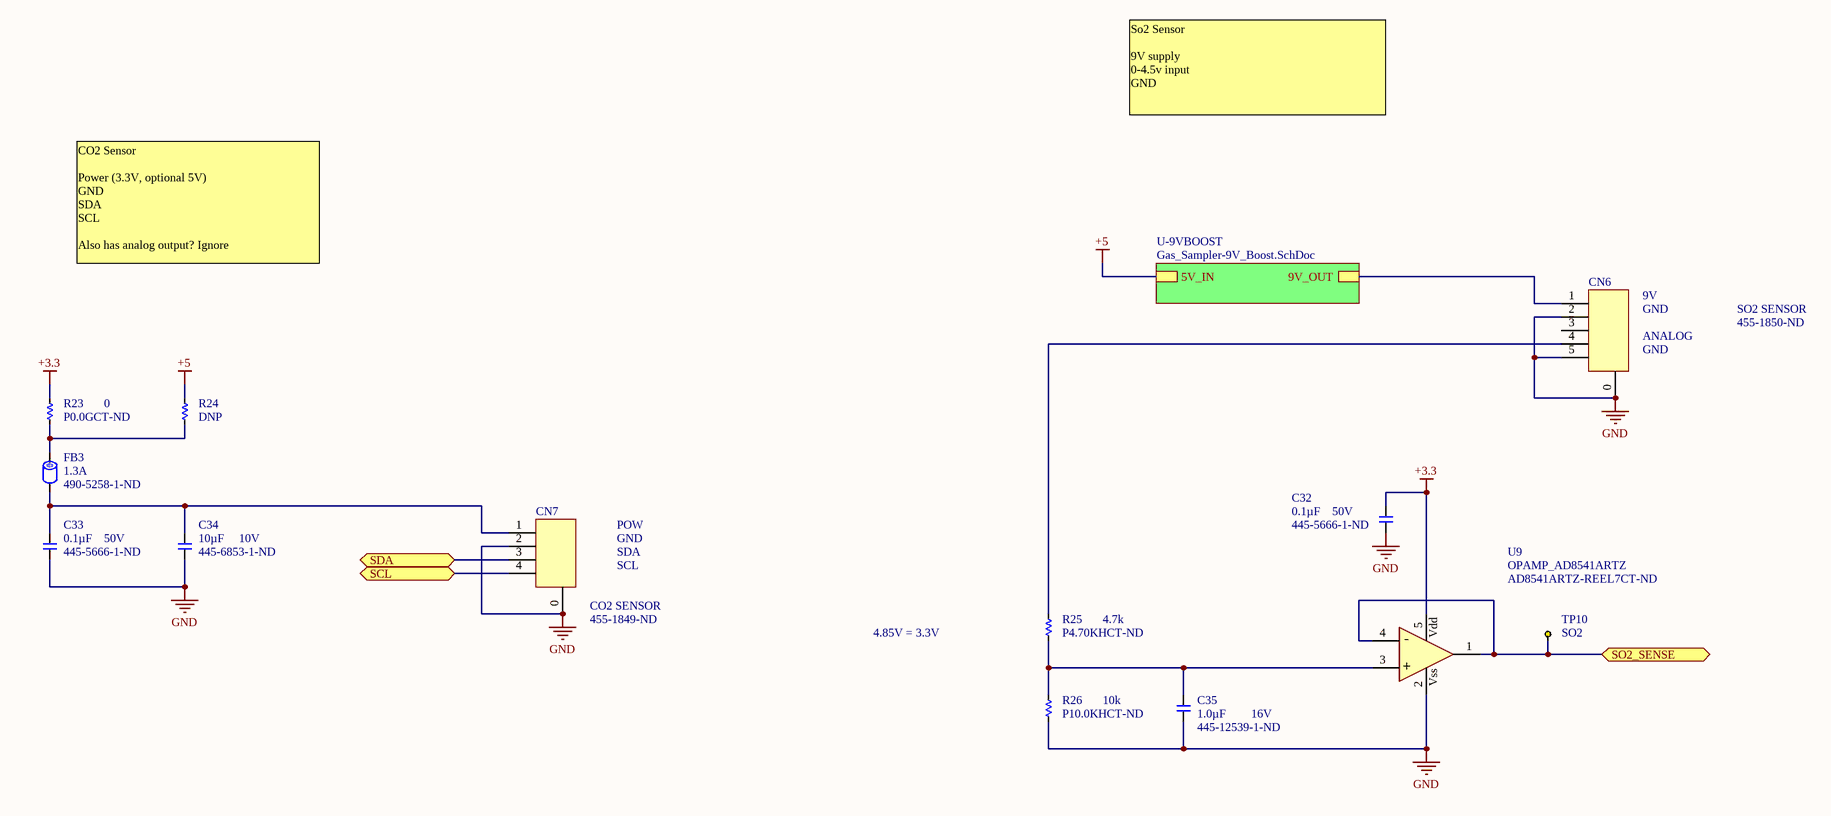
[diagram p10: Gas_Sampler-Sensors.SchDoc]

### Parts
C32  value 0.1µF  Voltage - Rated: 50V  Supplier Part Number 1: 445-5666-1-ND  [C0603]  (hidden comment: CAP_CER_0603_0.1UF_50V_10%_X7R)
C33  value 0.1µF  Voltage - Rated: 50V  Supplier Part Number 1: 445-5666-1-ND  [C0603]  (hidden comment: CAP_CER_0603_0.1UF_50V_10%_X7R)
C34  value 10µF  Voltage - Rated: 10V  Supplier Part Number 1: 445-6853-1-ND  [C0603]  (hidden comment: CAP_CER_0603_10UF_10V_20%_X5R)
C35  value 1.0µF  Supplier Part Number 1: 445-12539-1-ND  Voltage - Rated: 16V  [C0603]  (hidden comment: CAP_CER_0603_1UF_16V_10%_X7R)
CN6  SO2 SENSOR  Supplier Part Number 1: 455-1850-ND  [JST_PA_S05B-PASK-2]
CN7  CO2 SENSOR  Supplier Part Number 1: 455-1849-ND  [JST_PA_S04B-PASK-2]
FB3  Current Rating (Max): 1.3A  Supplier Part Number 1: 490-5258-1-ND  [R0603]  (hidden comment: FERRITE_BEAD_0603_1.3A_600_OHM)
R23  value 0  Supplier Part Number 1: P0.0GCT-ND  [R0603]  (hidden comment: RES_0603_0_OHM_1/10W)
R24  value DNP  [R0603]  (hidden comment: RES_0603_DNP)  (no BOM)
R25  value 4.7k  Supplier Part Number 1: P4.70KHCT-ND  [R0603]  (hidden comment: RES_0603_4.7K_OHM_1/10W_1%)
R26  value 10k  Supplier Part Number 1: P10.0KHCT-ND  [R0603]  (hidden comment: RES_0603_10K_OHM_1/10W_1%)
TP10  SO2  [TP_KEYSTONE_5001]
U9  OPAMP_AD8541ARTZ  Supplier Part Number 1: AD8541ARTZ-REEL7CT-ND  [5SOT23]

### Sub-sheets
U-9VBOOST = Gas_Sampler-9V_Boost.SchDoc: 9V_OUT, 5V_IN

### Ports
SCL, SDA, SO2_SENSE

### Nets
+3.3: C32.1 R23.2 U9.5(VDD)
+5: R24.2 ; sheet U-9VBOOST/5V_IN
GND: C32.2 C33.2 C34.2 C35.2 CN6.0(CHAS) CN6.2 CN6.5 CN7.0(CHAS) CN7.2 R26.1 U9.2(VSS)
SCL: CN7.4 ; port SCL
SDA: CN7.3 ; port SDA
SO2_SENSE: TP10.1 U9.1(OUT) U9.4(IN-) ; port SO2_SENSE
NetC13_1: CN6.1 ; sheet U-9VBOOST/9V_OUT
NetC33_1: C33.1 C34.1 CN7.1 FB3.2
NetC35_1: C35.1 R25.1 R26.2 U9.3(IN+)
NetCN6_4: CN6.4 R25.2
NetFB3_1: FB3.1 R23.1 R24.1

Not connected (* = marked no-connect by the designer): CN6 3

### Notes on the sheet
- So2 Sensor
  9V supply
  0-4.5v input
  GND
- CO2 Sensor
  Power (3.3V, optional 5V)
  GND
  SDA
  SCL
  Also has analog output? Ignore
- (near CN6) 9V
- (near CN6) GND
- (near CN6) ANALOG
- POW
- GND
- SDA
- SCL
- 4.85V = 3.3V
- CONFIDENTIAL DOCUMENT
- DUPLICATION PROHIBITED
- ENGINEER
- PCB FAB #
- SCH #
- REV
- Sensible
- Robotics
- THIS DOCUMENT CONTAINS INFORMATION AND OR DATA, WHICH IS PROPRIETARY AND CONFIDENTIAL TO SENSIBLE ROBOTICS LLC.  THIS INFORMATION AND OR DATA, IS TO BE USED ONLY FOR THE BENEFIT OF THE SUPPLIER, AND IS NOT TO BE USED FOR THE BENEFIT OF OTHER PARTIES WITHOUT WRITTEN CONSENT.
- DATE
- PCB ASSY #
- SIZE
- Tabloid
- SHEET
- OF
- FILE
- (in symbol OPAMP_AD8541ARTZ) Vdd; +; Vss

### Library data of the parts
C32 C33 = CAP_CER_0603_0.1UF_50V_10%_X7R: as C37 on sheet Gas_Sampler-Vin; Supplier 1: Digi-Key; RoHS: RoHS Compliant; Category: Capacitors; Stock 1: 320000; Pricing 1: 1=0.1, 10=0.072, 100=0.033, 250=0.027, 500=0.0231, 1000=0.018 (USD); Packaging: Cut Tape (CT); Tolerance: ±10%; Temperature Coefficient: X7R; Mounting Type: Surface Mount, MLCC; Operating Temperature: -55°C ~ 125°C; Applications: Automotive; Ratings: AEC-Q200; Package / Case: 0603 (1608 Metric); Size / Dimension: 0.063" L x 0.031" W (1.60mm x 0.80mm); Height - Seated (Max): -; Thickness (Max): 0.035" (0.90mm); Lead Spacing: -; Features: -; Lead Style: -; ComponentLink1URL: http://product.tdk.com/capacitor/mlcc/en/documents/mlcc_automotive_general_en.pdf; ComponentLink1Description: http://product.tdk.com/capacitor/mlcc/en/documents/mlcc_automotive_general_en.pdf
C34 = CAP_CER_0603_10UF_10V_20%_X5R: as C2 on sheet Gas_Sampler-3.3V_LDO; Supplier 1: Digi-Key; RoHS: RoHS Compliant; Packaging: Cut Tape (CT); Part Status: Active; Temperature Coefficient: X5R; Operating Temperature: -55°C ~ 85°C; Features: Low ESL; Applications: General Purpose; Mounting Type: Surface Mount, MLCC; Package / Case: 0603 (1608 Metric); Size / Dimension: 0.063" L x 0.032" W (1.60mm x 0.80mm); Thickness (Max): 0.035" (0.90mm); ComponentLink1URL: https://product.tdk.com/info/en/catalog/datasheets/mlcc_commercial_general_en.pdf; ComponentLink1Description: https://product.tdk.com/info/en/catalog/datasheets/mlcc_commercial_general_en.pdf
C35 = CAP_CER_0603_1UF_16V_10%_X7R: as C38 on sheet Gas_Sampler-Vin; Supplier 1: Digi-Key; RoHS: RoHS Compliant; Packaging: Cut Tape (CT); Tolerance: ±10%; Temperature Coefficient: X7R; Mounting Type: Surface Mount, MLCC; Operating Temperature: -55°C ~ 125°C; Applications: Automotive; Ratings: AEC-Q200; Package / Case: 0603 (1608 Metric); Size / Dimension: 0.063" L x 0.031" W (1.60mm x 0.80mm); Thickness (Max): 0.035" (0.90mm); ComponentLink1URL: http://product.tdk.com/capacitor/mlcc/en/documents/mlcc_automotive_general_en.pdf; ComponentLink1Description: http://product.tdk.com/capacitor/mlcc/en/documents/mlcc_automotive_general_en.pdf
CN6 = JST_PA_RA_TH_GUIDE_5POS: CONN HEADER PA 5POS SIDE 2MM TIN; Manufacturer: JST Sales America Inc.; Manufacturer Part Number: S05B-PASK-2(LF)(SN); Connector Type: Header, Shrouded; Number of Positions: 5; Number of Positions Loaded: All; Pitch: 0.079" (2.00mm); Supplier 1: Digi-Key; Packaging: Bulk; Contact Type: Male Pin; Contact Mating Length: 0.126" (3.20mm); Mounting Type: Through Hole, Right Angle; Termination: Kinked Pin, Solder; Fastening Type: Locking Ramp; Features: Board Guide; Contact Finish: Tin; ComponentLink1URL: http://www.jst-mfg.com/product/pdf/eng/ePA-F.pdf; ComponentLink1Description: http://www.jst-mfg.com/product/pdf/eng/ePA-F.pdf
CN7 = JST_PA_RA_TH_GUIDE_4POS: CONN HEADER PA 4POS SIDE 2MM TIN; Manufacturer: JST Sales America Inc.; Manufacturer Part Number: S04B-PASK-2(LF)(SN); Connector Type: Header, Shrouded; Number of Positions: 4; Number of Positions Loaded: All; Pitch: 0.079" (2.00mm); Supplier 1: Digi-Key; Packaging: Bulk; Contact Type: Male Pin; Contact Mating Length: 0.126" (3.20mm); Mounting Type: Through Hole, Right Angle; Termination: Kinked Pin, Solder; Fastening Type: Locking Ramp; Features: Board Guide; Contact Finish: Tin; ComponentLink1URL: http://www.jst-mfg.com/product/pdf/eng/ePA-F.pdf; ComponentLink1Description: http://www.jst-mfg.com/product/pdf/eng/ePA-F.pdf
FB3 = FERRITE_BEAD_0603_1.3A_600_OHM: FERRITE BEAD 600 OHM 0603 1LN; Manufacturer: Murata Electronics North America; Manufacturer Part Number: BLM18KG601SN1D; Filter Type: Power Line; Number of Lines: 1; Impedance @ Frequency: 600 Ohm @ 100MHz; DC Resistance (DCR) (Max): 150 mOhm; Supplier 1: Digi-Key; RoHS: RoHS Compliant; Category: Filters; Stock 1: 300163; Packaging: Cut Tape (CT); Operating Temperature: -55°C ~ 125°C; Package / Case: 0603 (1608 Metric); Mounting Type: Surface Mount; Height (Max): 0.037" (0.95mm); Size / Dimension: 0.063" L x 0.032" W (1.60mm x 0.80mm); ComponentLink1URL: http://media.digikey.com/pdf/Data%20Sheets/Murata%20PDFs/BLM18yyyyyyN1x.pdf; ComponentLink1Description: http://media.digikey.com/pdf/Data%20Sheets/Murata%20PDFs/BLM18yyyyyyN1x.pdf
R23 = RES_0603_0_OHM_1/10W: RES 0.0 OHM 1/10W JUMP 0603 SMD; Manufacturer: Panasonic Electronic Components; Manufacturer Part Number: ERJ-3GEY0R00V; Power (Watts): 0.1W, 1/10W; Tolerance: Jumper; Supplier 1: Digi-Key; Category: Resistors; Packaging: Cut Tape (CT); Composition: Thick Film; Package / Case: 0603 (1608 Metric); Supplier Device Package: 0603; Size / Dimension: 0.063" L x 0.031" W (1.60mm x 0.80mm); Height: 0.022" (0.55mm); Number of Terminations: 2; ComponentLink1URL: http://industrial.panasonic.com/www-cgi/jvcr13pz.cgi?E+PZ+3+AOA0001+ERJ3GEY0R00V+7+WW; ComponentLink1Description: http://industrial.panasonic.com/www-cgi/jvcr13pz.cgi?E+PZ+3+AOA0001+ERJ3GEY0R00V+7+WW
R24 = RES_0603_DNP: RES DNP 0603 SMD; Part Number: 000-00000-00; Supplier 1: Digi-Key; Supplier Part Number 1: DNP
R25 = RES_0603_4.7K_OHM_1/10W_1%: RES 4.7K OHM 1/10W 1% 0603 SMD; Manufacturer: Panasonic Electronic Components; Manufacturer Part Number: ERJ-3EKF4701V; Power (Watts): 0.1W, 1/10W; Temperature Coefficient: ±100ppm/°C; Supplier 1: Digi-Key; Category: Resistors; Packaging: Cut Tape (CT); Composition: Thick Film; Tolerance: ±1%; Package / Case: 0603 (1608 Metric); Supplier Device Package: 0603; Size / Dimension: 0.063" L x 0.031" W (1.60mm x 0.80mm); Height: 0.022" (0.55mm); Number of Terminations: 2; ComponentLink1URL: http://industrial.panasonic.com/www-cgi/jvcr13pz.cgi?E+PZ+3+AOA0002+ERJ3EKF4701V+7+WW; ComponentLink1Description: http://industrial.panasonic.com/www-cgi/jvcr13pz.cgi?E+PZ+3+AOA0002+ERJ3EKF4701V+7+WW
R26 = RES_0603_10K_OHM_1/10W_1%: as R31 on sheet Gas_Sampler-Vin; Supplier 1: Digi-Key; RoHS: RoHS Compliant; Packaging: Cut Tape (CT); Composition: Thick Film; Tolerance: ±1%; Package / Case: 0603 (1608 Metric); Supplier Device Package: 0603; Size / Dimension: 0.063" L x 0.031" W (1.60mm x 0.80mm); Height: 0.022" (0.55mm); Number of Terminations: 2; ComponentLink1URL: http://industrial.panasonic.com/www-cgi/jvcr13pz.cgi?E+PZ+3+AOA0002+ERJ3EKF1002V+7+WW; ComponentLink1Description: http://industrial.panasonic.com/www-cgi/jvcr13pz.cgi?E+PZ+3+AOA0002+ERJ3EKF1002V+7+WW
TP10 = TEST_KEYSTONE5001: as TP15 on sheet Gas_Sampler-Vin; Supplier 1: Digi-Key; Supplier Part Number 1: 5001K-ND; RoHS: RoHS Compliant; Category: Test and Measurement; Stock 1: 341830; Pricing 1: 1=0.33, 10=0.309, 50=0.2252, 100=0.2164, 250=0.19432, 500=0.18548, 1000=0.15456, 2500=0.14131, 5000=0.13248 (USD); Packaging: Bulk; Type: PC Test Point, Miniature; Terminal: 0.010" x 0.020" (0.25mm x 0.51mm) Phosphor Bronze Wire, Silver Plate; Mounting Type: 0.040" (1.02mm) Hole Diameter; Material: Base, Nylon 46, UL 94V-0; Color: Black; ComponentLink1URL: http://www.keyelco.com/product-pdf.cfm?p=1310; ComponentLink1Description: http://www.keyelco.com/product-pdf.cfm?p=1310
U9 = OPAMP_AD8541ARTZ: as U10 on sheet Gas_Sampler-Vin; Supplier 1: Digi-Key; RoHS: RoHS Compliant; Category: Integrated Circuits (ICs); Stock 1: 26612; Pricing 1: 1=0.85, 10=0.747, 25=0.6604, 100=0.5755, 250=0.50096, 500=0.42642, 1000=0.34155 (USD); Packaging: Cut Tape (CT); -3db Bandwidth: -; Operating Temperature: -40°C ~ 125°C; Mounting Type: Surface Mount; Package / Case: SC-74A, SOT-753; Supplier Device Package: SOT-23-5; ComponentLink1URL: http://www.analog.com/static/imported-files/data_sheets/AD8541_8542_8544.pdf; ComponentLink1Description: http://www.analog.com/static/imported-files/data_sheets/AD8541_8542_8544.pdf